# EAGLE design arduinoVisor4 (EAGLE 9.5.2)

## Sheet 1 of 2
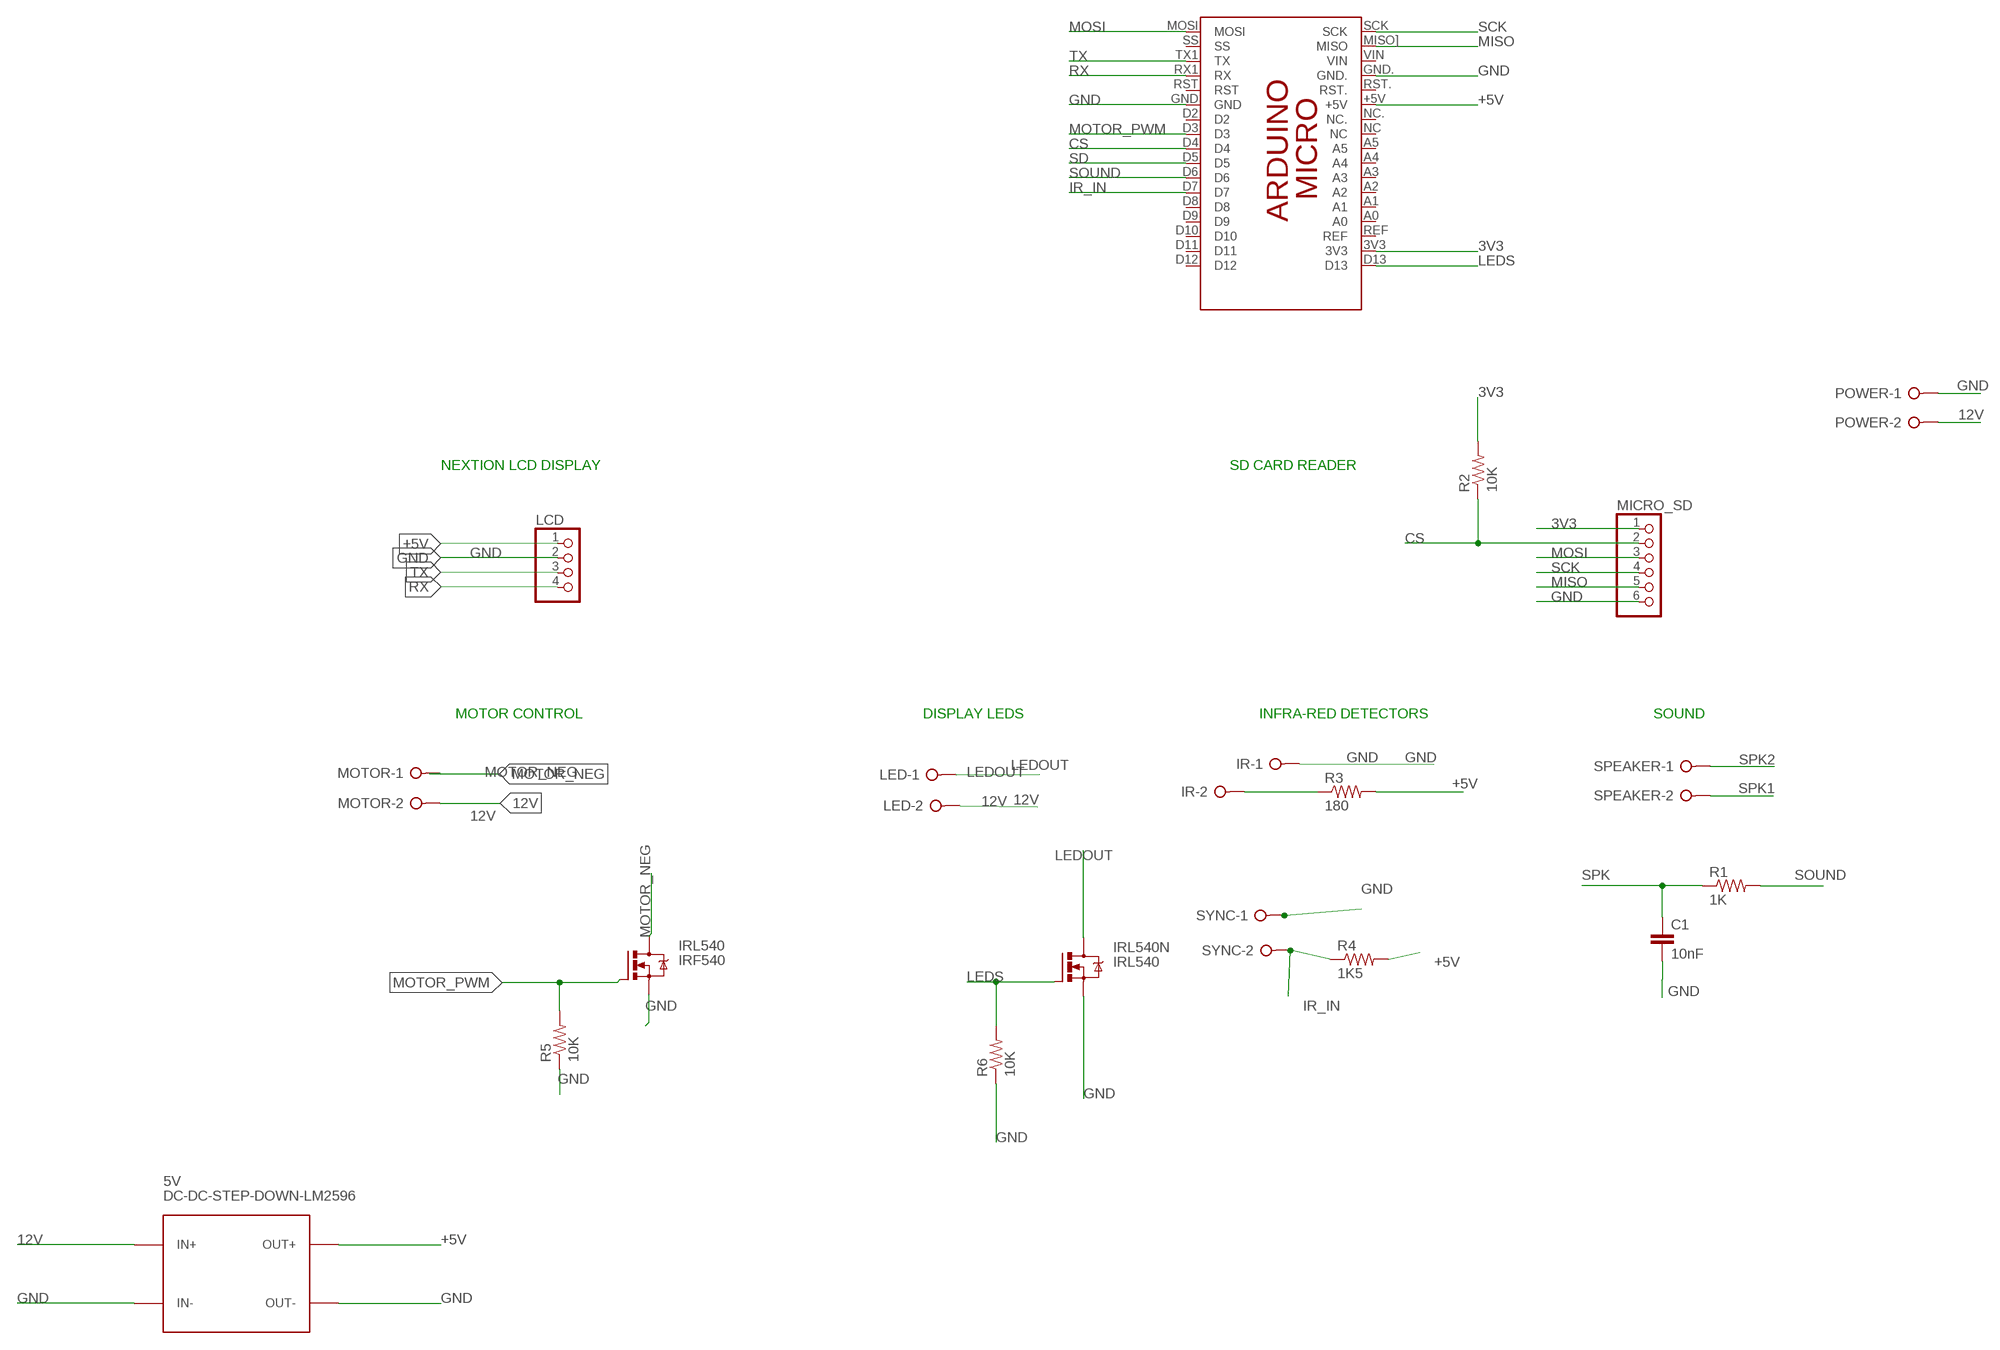
[diagram p0: schematic, sheet 1]

### Parts
5V  DC-DC-STEP-DOWN-LM2596  [DC-DC-STEP-DOWN-LM2596]
C1  10nF  C2.5/2  [C2.5-2]
IR  W237-02P  [W237-132]
IRL540  IRF540  [TO220BV]
IRL540N  IRL540  IRF540  [TO220BV]
LCD  PINHD-1X4  [1X04]
LED  W237-02P  [W237-132]
MICRO_SD  PINHD-1X6  [1X06]
MOTOR  W237-02P  [W237-132]
PCB2  ARDUINO_MICRO  [ARDUINO_MICRO]
POWER  W237-02P  [W237-132]
R1  1K  R-US_0207/10  [0207/10]
R2  10K  R-US_0207/10  [0207/10]
R3  180  R-US_0207/10  [0207/10]
R4  1K5  R-US_0207/10  [0207/10]
R5  10K  R-US_0207/10  [0207/10]
R6  10K  R-US_0207/10  [0207/10]
SPEAKER  W237-02P  [W237-132]
SYNC  W237-02P  [W237-132]

### Nets
3V3: MICRO_SD.1 PCB2.3V3 R2.2
12V: 5V.IN+ LED.2 MOTOR.2 POWER.2
+5V: 5V.OUT+ LCD.1 PCB2.+5V R3.2 R4.2 ; also sheet 2
CS: MICRO_SD.2 PCB2.D4 R2.1
GND: 5V.IN- 5V.OUT- C1.2 IR.1 IRL540.S IRL540N.S LCD.2 MICRO_SD.6 PCB2.GND PCB2.GND. POWER.1 R5.1 R6.1 SYNC.1 ; also sheet 2
IR_IN: PCB2.D7 R4.1 SYNC.2
IR_OUT: IR.2 R3.1
LEDOUT: IRL540N.D LED.1
LEDS: IRL540N.G PCB2.D13 R6.2
MISO: MICRO_SD.5 PCB2.MISO](MISO)
MOSI: MICRO_SD.3 PCB2.MOSI
MOTOR_NEG: IRL540.D MOTOR.1
MOTOR_PWM: IRL540.G PCB2.D3 R5.2
RX: LCD.4 PCB2.RX1(RX)
SCK: MICRO_SD.4 PCB2.SCK
SD: PCB2.D5 ; also sheet 2
SOUND: PCB2.D6 R1.2
SPK: C1.1 R1.1 ; also sheet 2
SPK1: SPEAKER.2 ; also sheet 2
SPK2: SPEAKER.1 ; also sheet 2
TX: LCD.3 PCB2.TX1(TX)
Unconnected: PCB2.A0 PCB2.A1 PCB2.A2 PCB2.A3 PCB2.A4 PCB2.A5 PCB2.D2 PCB2.D8 PCB2.D9 PCB2.D10 PCB2.D11 PCB2.D12 PCB2.NC PCB2.NC. PCB2.REF PCB2.RST PCB2.RST. PCB2.SS PCB2.VIN

### Notes on the sheet
- NEXTION LCD DISPLAY | SD CARD READER
- MOTOR CONTROL | DISPLAY LEDS | INFRA-RED DETECTORS | SOUND

## Sheet 2 of 2
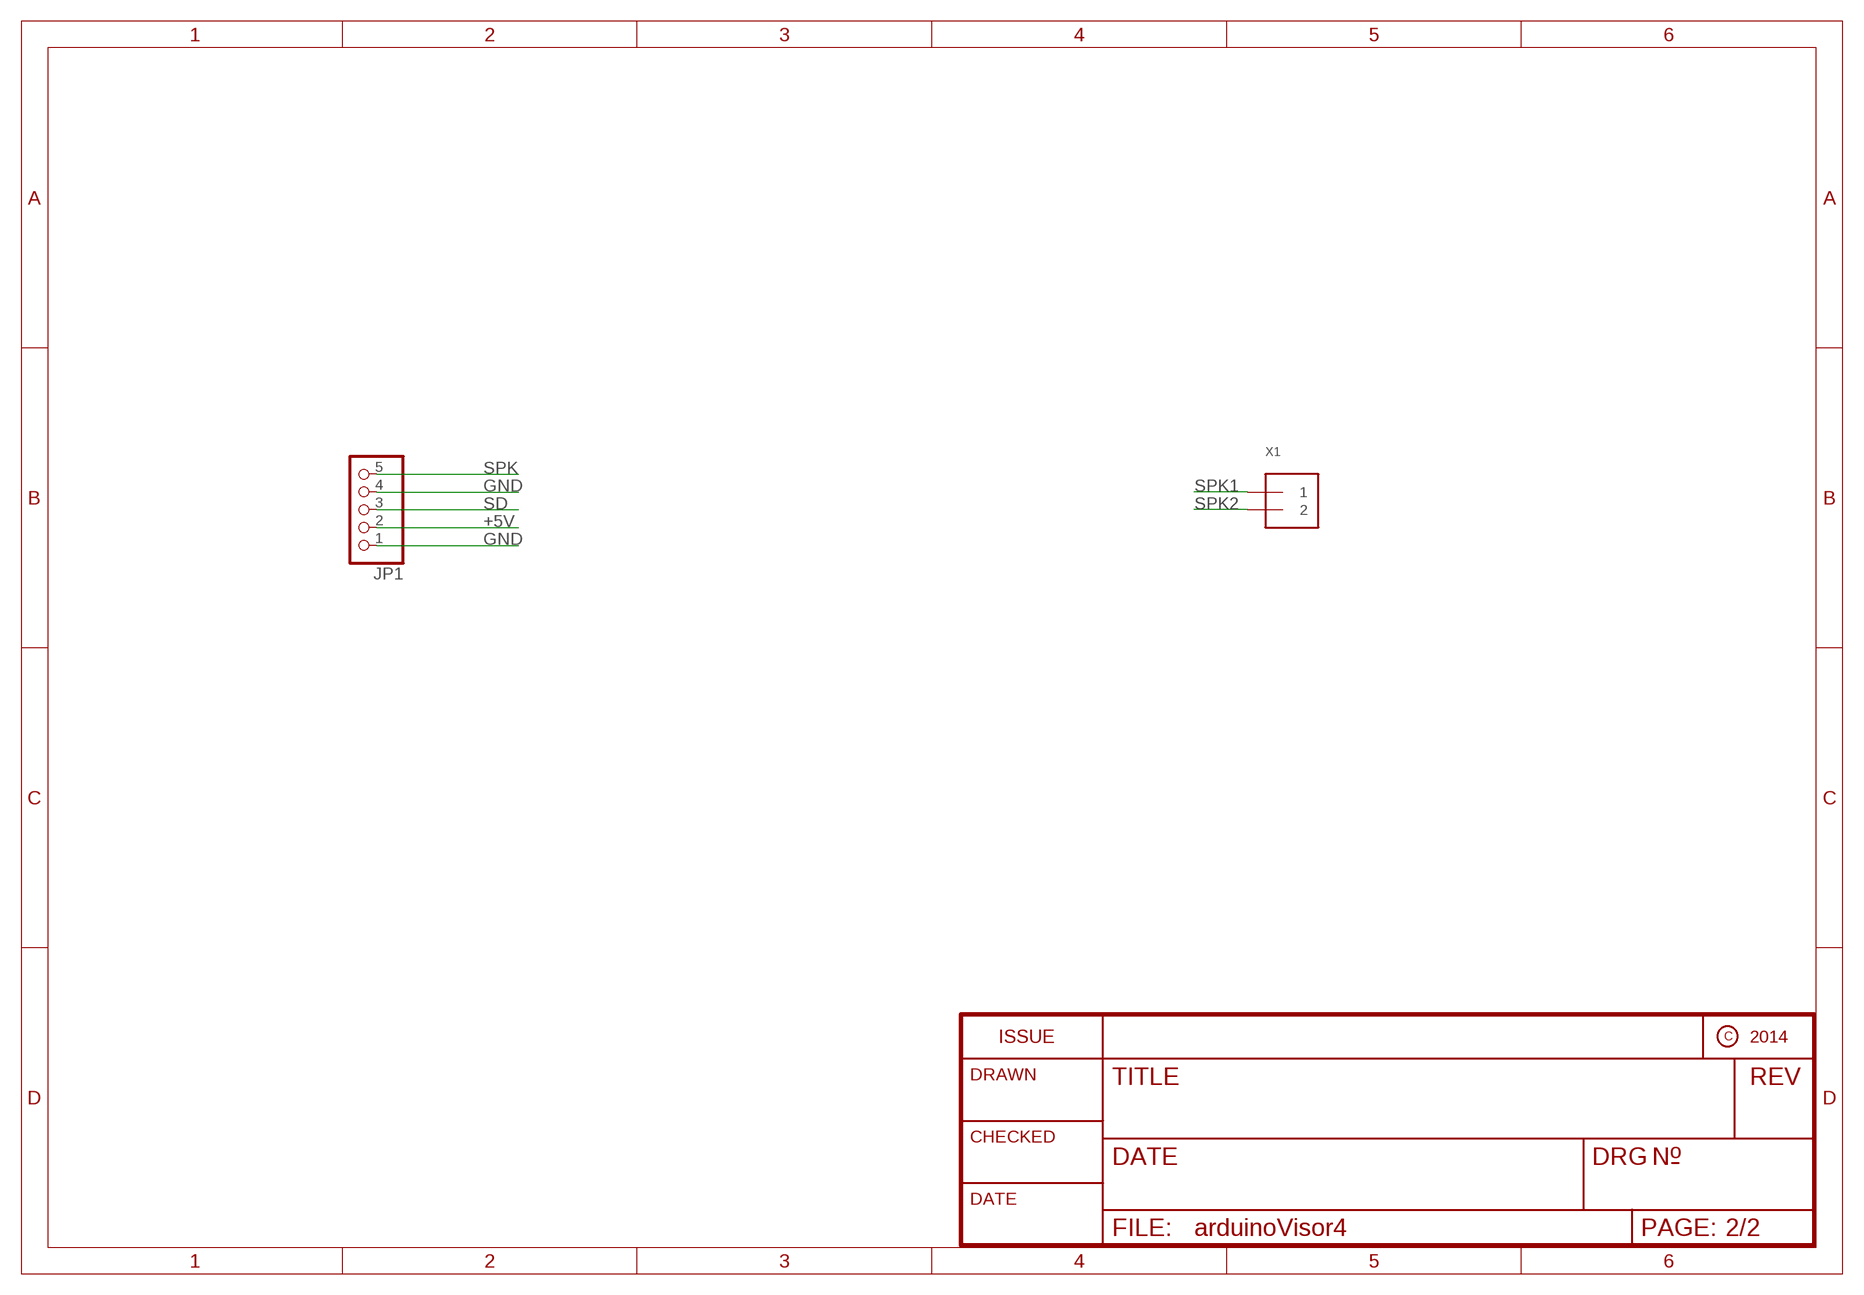
[diagram p1: schematic, sheet 2]

### Parts
JP1  HEADER-1X570MIL  [1X05_ROUND_70]
X1  TERMBLOCK_1X2  [TERMBLOCK_1X2-3.5MM]

### Nets
+5V: JP1.2 ; also sheet 1
GND: JP1.1 JP1.4 ; also sheet 1
SD: JP1.3 ; also sheet 1
SPK: JP1.5 ; also sheet 1
SPK1: X1.1 ; also sheet 1
SPK2: X1.2 ; also sheet 1

## Library data of the parts
5V = diy-modules boo:DC-DC-STEP-DOWN-LM2596: DC/DC Step-Down Regulator based on LM2596-ADJ chip LM2596 datasheet available here: http://www.ti.com/lit/ds/symlink/lm2596.pdf Click here to find device on ebay.com <http://www.ebay.com/sch/lm2596+power+regulator>
C1 = capacitor-wima:C: CAPACITOR naming: grid - package width
IR LED MOTOR POWER SPEAKER SYNC = con-wago-508:W237-02P: WAGO SREW CLAMP; OC_FARNELL: unknown; OC_NEWARK: unknown
IRL540 IRL540N = transistor-power:IRF540: HEXFET Power MOSFET
JP1 = microbuilder:HEADER-1X5: PIN HEADER
LCD = pinhead:PINHD-1X4: PIN HEADER
MICRO_SD = pinhead:PINHD-1X6: PIN HEADER
PCB2 = E14_Arduino_revC 2 boo:ARDUINO_MICRO: Device for representing an Arduino Micro board with a footprint in an EAGLE design. Created by Dave Young for Element14. More EAGLE documentation at: http://www.element14.com/community/community/knode/cadsoft_eagle
R1-R6 = rcl:R-US_: RESISTOR, American symbol
X1 = microbuilder:TERMBLOCK_1X2: 3.5mm Terminal block http://www.ladyada.net/library/pcb/eaglelibrary.html

## Board
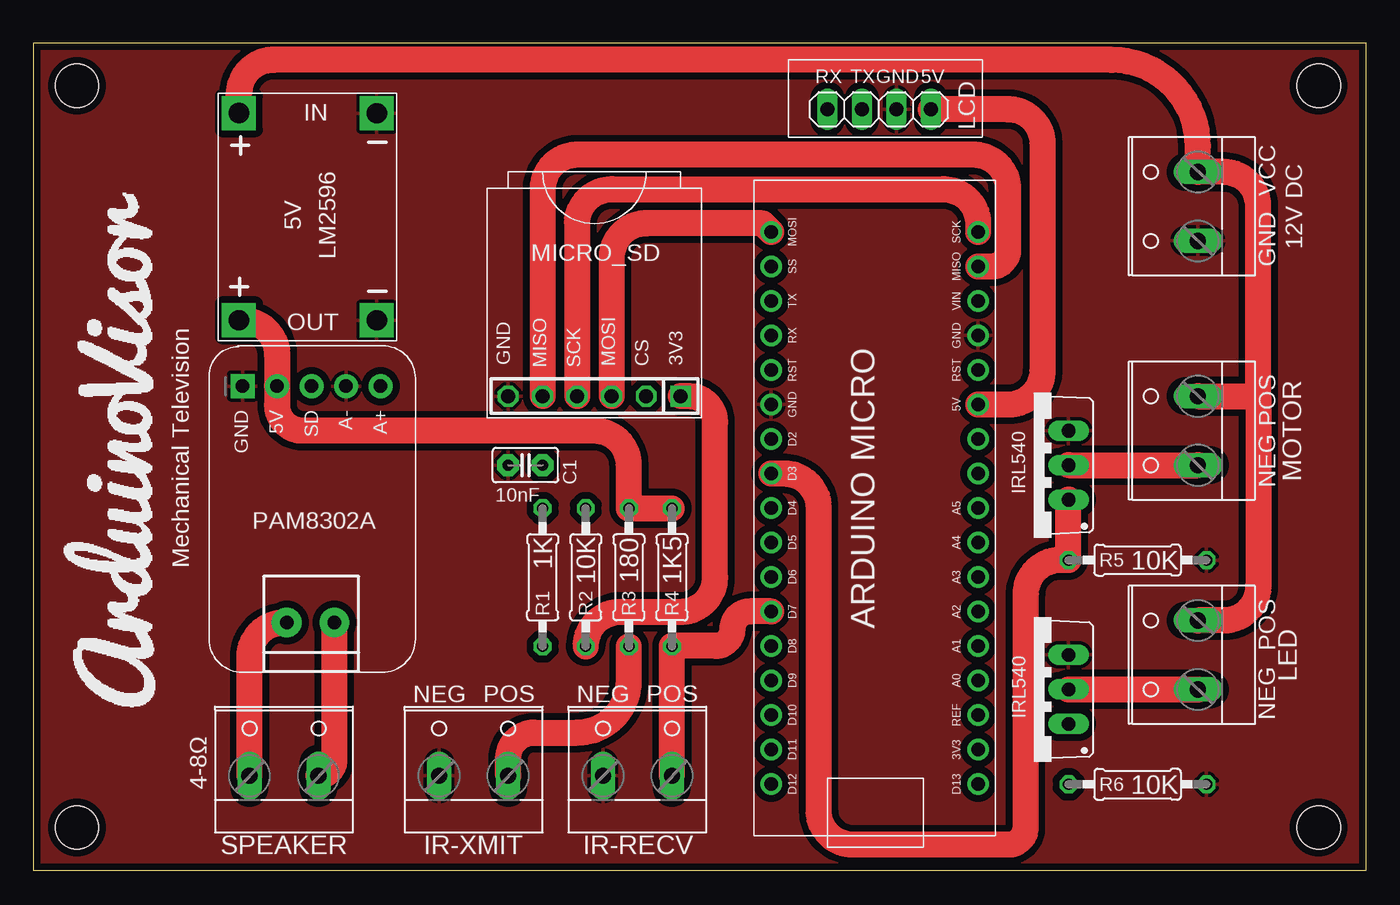
[diagram p2: board, top side]
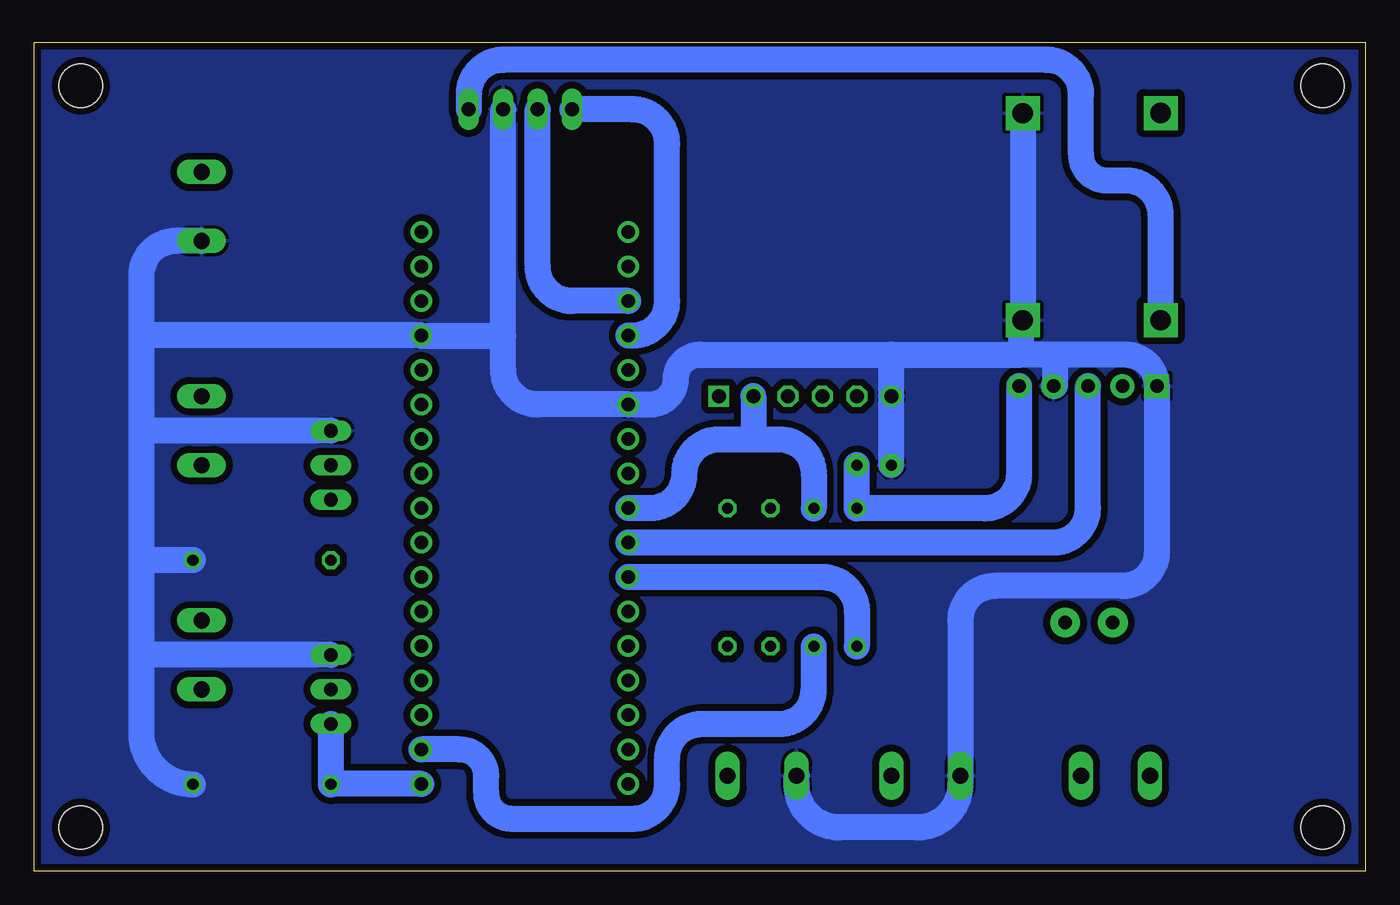
[diagram p3: board, bottom side, seen from below]

Size 98.07 x 60.96 mm. Coordinates in mm from the lower left corner, seen from the top.
Outline: 0,60.96 98.07,60.96 98.07,0 0,0 0,60.96
Copper layers (1*16): Top 0.035mm / dielectric 1.5mm / Bottom 0.035mm
Design rules "SeeedStudio_2layer_DRU_no_angle_20140221": minimum track width 6mil, minimum drill 12mil, track to track 6mil, track to pad 6mil, pad to pad 6mil, via to via 6mil, smd to smd 0mil, copper to edge 10mil, drill to drill 10mil, minimum pad ring 10mil, minimum via ring 6mil, stop-mask expansion 2mil, vias tented up to drill 100mil, thermal gap 10mil
Holes 3.2 mm at 3.17,57.78 94.61,57.78 3.17,3.17 94.61,3.17

### Footprints (pad centres in the part's own frame; a part is rotated, then mirrored left to right if it is on the bottom)
DC-DC-STEP-DOWN-LM2596 = drill 1.5 pad 2.5 square: IN+ 1.388,0.485; IN- 1.388,10.641; OUT+ 16.632,0.48; OUT- 16.631,10.641
C2.5-2 = drill 0.813 pad 1.6 octagon: 1 -1.27,0; 2 1.27,0
W237-132 = drill 1.194 long: 1 -2.54,-0.635; 2 2.54,-0.635
TO220BV = drill 1.016 long: D 0,-2.54; G -2.54,-2.54; S 2.54,-2.54
1X05_ROUND_70 = drill 1 pad 1.778 square: 1 -5.08,0 | drill 1 pad 1.778: 2 -2.54,0; 3 0,0; 4 2.54,0; 5 5.08,0
1X04 = drill 1.016 long: 1 -3.81,0; 2 -1.27,0; 3 1.27,0; 4 3.81,0
1X06 = drill 1.016 square: 1 -6.35,0 | drill 1.016 octagon: 2 -3.81,0; 3 -1.27,0; 4 1.27,0; 5 3.81,0; 6 6.35,0
ARDUINO_MICRO = drill 1.016 pad 1.575: 3V3 6.35,1.27; +5V 31.75,1.27; A0 11.43,1.27; A1 13.97,1.27; A2 16.51,1.27; A3 19.05,1.27; A4 21.59,1.27; A5 24.13,1.27; D2 29.21,16.51; D3 26.67,16.51; D4 24.13,16.51; D5 21.59,16.51; D6 19.05,16.51; D7 16.51,16.51; D8 13.97,16.51; D9 11.43,16.51; D10 8.89,16.51; D11 6.35,16.51; D12 3.81,16.51; D13 3.81,1.27; GND 31.75,16.51; GND. 36.83,1.27; MISO] 41.91,1.27; MOSI 44.45,16.51; NC 26.67,1.27; NC. 29.21,1.27; REF 8.89,1.27; RST 34.29,16.51; RST. 34.29,1.27; RX1 36.83,16.51; SCK 44.45,1.27; SS 41.91,16.51; TX1 39.37,16.51; VIN 39.37,1.27
0207/10 = drill 0.813 octagon: 1 -5.08,0; 2 5.08,0
TERMBLOCK_1X2-3.5MM = drill 1 pad 2.184: 1 1.8,0; 2 -1.7,0

### Placement (x,y rotation side)
5V  14.61,57.15 270 top
C1  36.2,29.84 180 top
IR  32.38,7.62 0 top
IRL540  73.66,29.84 90 top
IRL540N  73.66,13.34 90 top
JP1  20.44,35.67 0 top
LCD  62.24,56.05 180 top
LED  85.09,15.88 90 top
MICRO_SD  41.27,34.92 180 top
MOTOR  85.09,32.38 90 top
PCB2  70.8,2.57 90 top
POWER  85.09,48.9 90 top
R1  37.47,21.59 270 top
R2  40.64,21.59 270 top
R3  43.81,21.59 90 top
R4  46.99,21.59 90 top
R5  81.28,22.86 180 top
R6  81.28,6.35 180 top
SPEAKER  18.41,7.62 0 top
SYNC  44.45,7.62 0 top
X1  20.32,18.27 0 top

### Tracks (layer width: path | path; a pad name or v marks a point on that pad's centre or on a via)
3V3
  Top 1.905: R2.2 arc-90 43.18,19.05 47.62,19.05 arc90 50.16,21.59 50.16,33.02 arc90 48.26,34.92 MICRO_SD.1
  Bottom 1.905: PCB2.3V3 66.7,8.92 arc90 64.77,6.99 64.77,5.71 arc-90 62.87,3.81 53.98,3.81 arc-90 51.44,6.35 51.44,8.26 arc90 48.9,10.79 43.18,10.79 arc-90 40.64,13.34 R2.2
12V
  Top 1.905: 5V.IN+ 15.09,57.15 arc-90 17.63,59.69 79.38,59.69 arc-90 85.72,53.34 POWER.2 87.63,51.44 arc-90 90.17,48.9 90.17,34.92 | MOTOR.2 90.17,34.92 | LED.2 87.63,18.41 arc90 90.17,20.95 90.17,34.92
+5V
  Top 1.905: 5V.OUT+ 15.36,40.52 arc-90 17.9,37.98 JP1.2 17.9,34.29 arc90 19.81,32.38 41.27,32.38 arc-90 43.81,29.84 R3.2 R4.2 | PCB2.+5V 71.75,34.32 arc90 74.3,36.86 74.3,53.51 arc90 71.75,56.05 LCD.1
  Bottom 1.905: 5V.OUT+ 15.09,48.26 arc-90 17.62,50.8 19.05,50.8 arc90 20.95,52.7 20.95,57.15 arc-90 23.5,59.69 63.51,59.69 arc-90 66.05,57.15 LCD.1
CS
  Bottom 1.905: PCB2.D4 52.67,26.7 arc-90 50.16,29.21 arc90 47.62,31.75 45.09,31.75 | 45.09,31.75 43.18,31.75 arc90 40.64,29.21 R2.1 | MICRO_SD.2 45.09,31.75
GND
  Bottom 1.905: 5V.IN- 5V.OUT- | 5V.OUT- arc-90 5V.OUT- | 63.51,39.37 63.51,36.86 arc-90 60.97,34.32 PCB2.GND 52.67,34.32 arc-90 50.8,36.2 arc90 49.02,37.98 34.92,37.98 | 63.51,39.37 LCD.2 | SYNC.1 41.91,6.35 arc-90 38.73,3.17 33.02,3.17 arc-90 29.84,6.35 IR.1 29.84,18.41 arc90 27.3,20.95 17.9,20.95 arc-90 15.36,23.5 JP1.1 arc-90 17.68,37.98 22.86,37.98 | 22.86,35.79 arc90 JP1.4 arc-90 22.86,35.79 | POWER.1 87.63,46.35 arc-90 90.17,43.81 90.17,39.37 | R6.1 arc90 90.17,10.16 90.17,15.88 | 90.17,39.37 90.17,32.38 | 90.17,32.38 90.17,22.86 | 90.17,22.86 90.17,15.88 | IRL540N.S 90.17,15.88 | IRL540.S 90.17,32.38 | 90.17,39.37 arc90 90.14,39.4 PCB2.GND. arc-90 69.5,39.37 63.51,39.37 | R5.1 90.17,22.86 | 22.86,37.98 25.4,37.98 | 5V.OUT- arc-90 25.4,40.37 25.4,37.98 | 22.86,35.79 22.86,37.98 | 34.92,37.98 25.4,37.98 | 34.92,37.98 MICRO_SD.6 C1.2
  pour Bottom (isolate 0.508): 0,60.96 0,0 98.42,0 98.42,60.96
  pour Top (isolate 0.508): 0,60.96 0,0 97.79,0 97.79,60.96
IR_IN
  Top 1.905: R4.1 arc-90 47.02,16.54 | 47.02,16.54 46.99,16.54 SYNC.2 | PCB2.D7 52.73,19.08 arc90 51.44,17.78 arc-90 50.2,16.54 47.02,16.54
IR_OUT
  Top 1.905: IR.2 34.92,8.26 arc-90 36.83,10.16 40.01,10.16 arc90 43.81,13.97 R3.1
LEDOUT
  Top 1.905: IRL540N.D LED.1
LEDS
  Bottom 1.905: PCB2.D13 76.17,6.38 arc-90 R6.2 IRL540N.G
MISO
  Top 1.905: MICRO_SD.5 37.47,50.16 arc-90 40.01,52.7 69.22,52.7 arc-90 71.75,50.16 71.75,45.72 arc-90 70.52,44.48 PCB2.MISO]
MOSI
  Top 1.905: PCB2.MOSI 53.66,47.66 45.09,47.66 arc90 42.55,45.12 MICRO_SD.3
MOTOR_NEG
  Top 1.905: IRL540.D MOTOR.1
MOTOR_PWM
  Top 1.905: PCB2.D3 55.24,29.24 arc-90 57.78,26.7 57.78,4.45 arc90 60.33,1.91 71.75,1.91 arc90 73.03,3.17 73.03,20.32 arc-90 75.56,22.86 R5.2 IRL540.G
RX
  Bottom 1.905: PCB2.RX1 53.98,39.4 arc-90 51.44,41.94 51.44,53.51 arc-90 53.98,56.05 LCD.4
SCK
  Top 1.905: MICRO_SD.4 40.01,47.62 arc-90 42.55,50.16 66.99,50.16 arc-90 69.53,47.62 PCB2.SCK
SD
  Bottom 1.905: PCB2.D5 22.98,24.16 arc-90 20.44,26.7 JP1.3
SOUND
  Bottom 1.905: PCB2.D6 40.01,21.62 arc90 37.47,19.08 R1.2
SPK
  Bottom 1.905: C1.1 R1.1 28.06,26.67 arc-90 25.52,29.21 JP1.5
SPK1
  Top 1.905: X1.1 22.12,8.15 arc-90 SPEAKER.2
SPK2
  Top 1.905: SPEAKER.1 15.88,15.73 arc-90 18.41,18.27 X1.2
TX
  Bottom 1.905: PCB2.TX1 58.43,41.94 arc90 60.97,44.48 LCD.3

### Text on the board
tPlace: RX | TX | GND | 5V | VCC | 12V DC | GND | GND | MISO | SCK | MOSI | CS | 3V3 | POS | GND | 5V | SD | A- | A+ | MOTOR | Mechanical Television | NEG | PAM8302A | POS | LED | NEG | NEG | POS | NEG | POS | 4-8Ω | SPEAKER | IR-XMIT | IR-RECV
tNames: IRL540 | IRL540